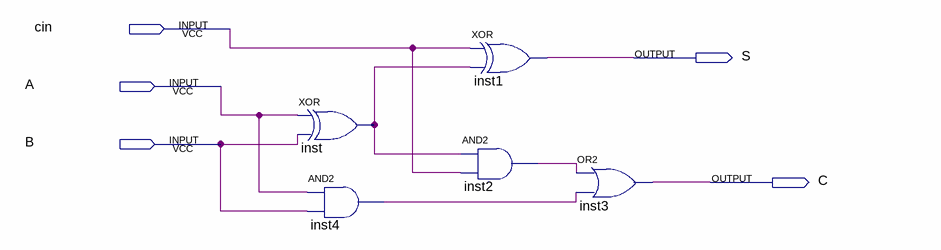
[diagram p0: schematic sheet]
// Quartus schematic Somador.bdf as structural Verilog: 5 symbols, 5 pins
module Somador (
  input  cin,
  input  A,
  input  B,
  output S,
  output C
);

  wire inst2_out, inst4_out, inst_out;

  xor inst (inst_out, A, B);
  and inst4 (inst4_out, A, B);
  xor inst1 (S, cin, inst_out);
  and inst2 (inst2_out, inst_out, cin);
  or inst3 (C, inst2_out, inst4_out);
endmodule
